# EasyEDA Pro project STM32F407ZG_Basics.epro, schematic Schematic1
Create Date: 2024-12-05; Page Name: P1; Project Name: STM32F407ZG_Basics; Schematic Name: Schematic1; Update Date: 2024-12-05; Company: 嘉立创EDA; Page Size: A4; Version: V1.0
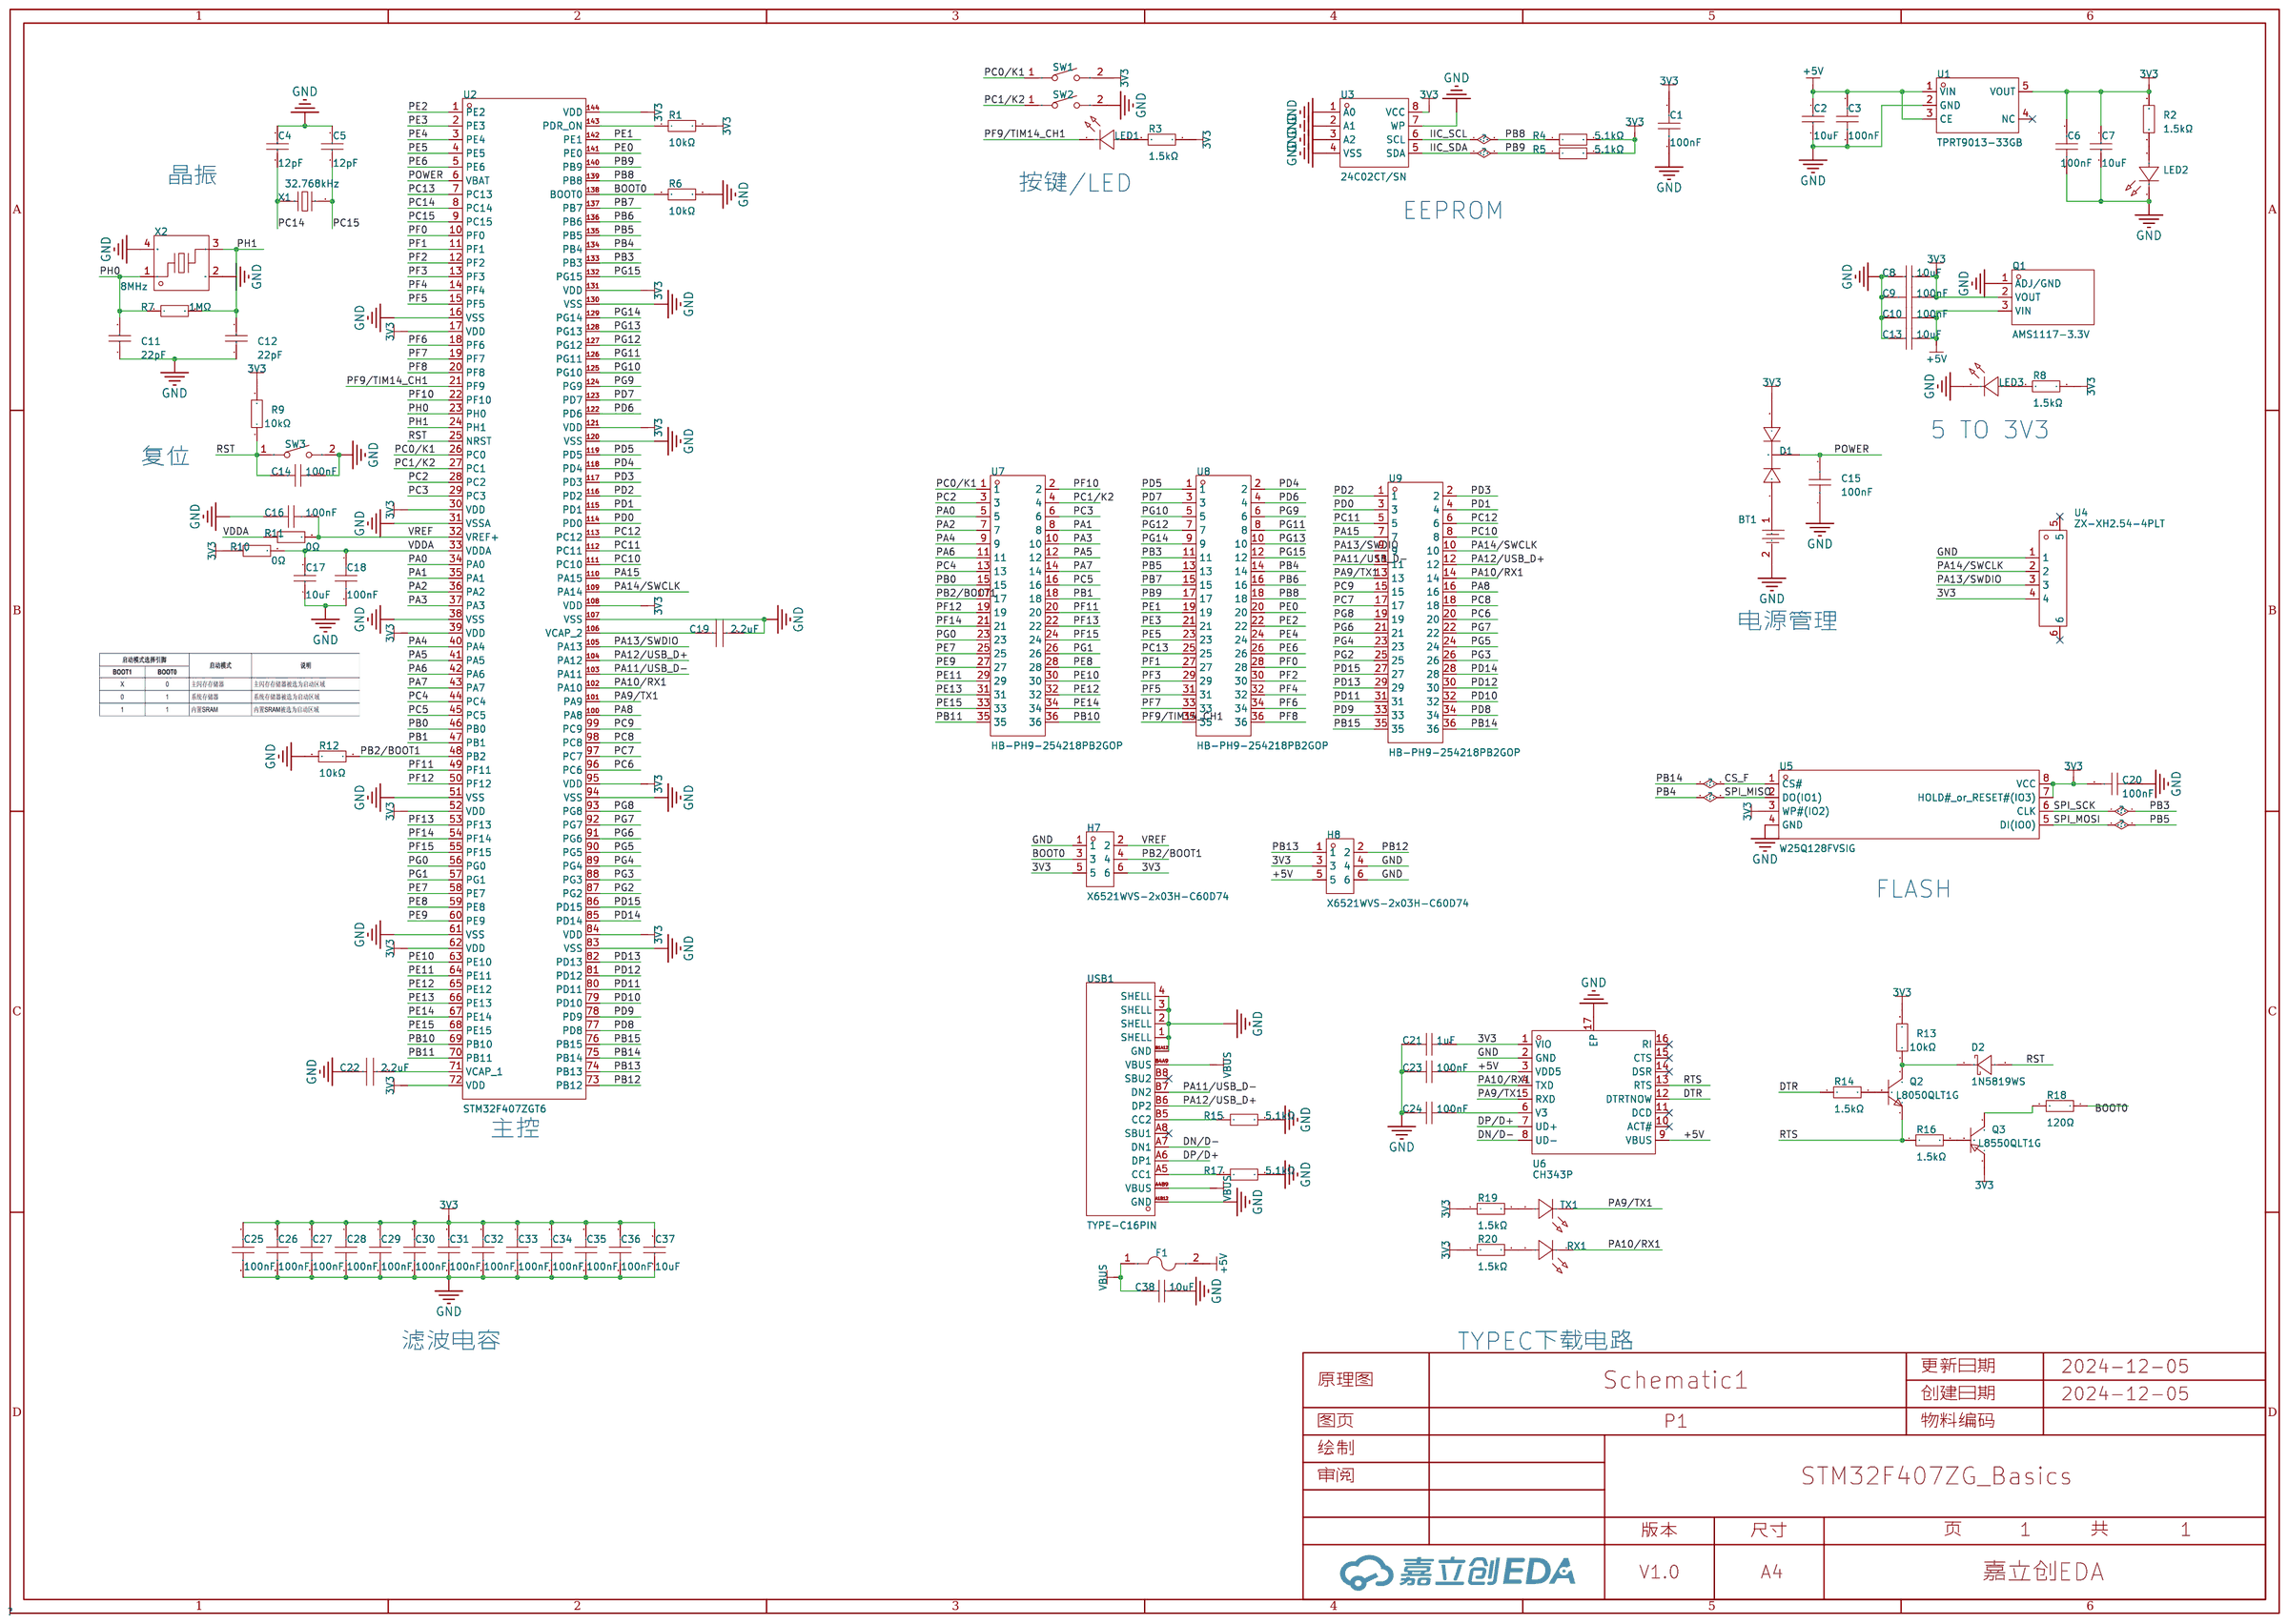
[diagram p0: schematic sheet]

## Parts
BT1  CR1220-2ZX  [BAT-SMD_CR1220-2ZX]
C1  100nF  [C0402]
C2  10uF  [C0402]
C3  100nF  [C0402]
C4  12pF  [C0402]
C5  12pF  [C0402]
C6  100nF  [C0402]
C7  10uF  [C0402]
C8  10uF  [C0402]
C9  100nF  [C0402]
C10  100nF  [C0402]
C11  22pF  [C0402]
C12  22pF  [C0402]
C13  10uF  [C0402]
C14  100nF  [C0402]
C15  100nF  [C0402]
C16  100nF  [C0402]
C17  10uF  [C0402]
C18  100nF  [C0402]
C19  2.2uF  [C0402]
C20  100nF  [C0402]
C21  1uF  [C0402]
C22  2.2uF  [C0402]
C23  100nF  [C0402]
C24  100nF  [C0402]
C25  100nF  [C0402]
C26  100nF  [C0402]
C27  100nF  [C0402]
C28  100nF  [C0402]
C29  100nF  [C0402]
C30  100nF  [C0402]
C31  100nF  [C0402]
C32  100nF  [C0402]
C33  100nF  [C0402]
C34  100nF  [C0402]
C35  100nF  [C0402]
C36  100nF  [C0402]
C37  10uF  [C0402]
C38  10uF  [C0402]
D1  SBAT54CLT1G  [SOT-23-3_L2.9-W1.6-P1.90-LS2.8-BR]
D2  1N5819WS  [SOD-323_L1.6-W1.3-LS2.6-RD-1]
F1  ASMD0805-075  [F0805]
H7  X6521WVS-2x03H-C60D74  [HDR-SMD_6P-P2.54-V-M-R2-C5-S7.4]
H8  X6521WVS-2x03H-C60D74  [HDR-SMD_6P-P2.54-V-M-R2-C5-S7.4]
LED1  XL-1608UGC-04  [LED0603-RD_GREEN]
LED2  XL-1608SURC-06  [LED0603-RD_RED]
LED3  XL-1608SURC-06  [LED0603-RD_RED]
Q1  AMS1117-3.3V  [SOT-89-3_L4.5-W2.5-P1.50-LS4.2-BR]
Q2  L8050QLT1G  [SOT-23-3_L2.9-W1.3-P1.90-LS2.4-BR]
Q3  L8550QLT1G  [SOT-23-3_L2.9-W1.6-P1.90-LS2.8-BR]
R1  10kΩ  [R0402]
R2  1.5kΩ  [R0402]
R3  1.5kΩ  [R0402]
R4  5.1kΩ  [R0402]
R5  5.1kΩ  [R0402]
R6  10kΩ  [R0402]
R7  1MΩ  [R0402]
R8  1.5kΩ  [R0402]
R9  10kΩ  [R0402]
R10  0Ω  [R0402]
R11  0Ω  [R0402]
R12  10kΩ  [R0402]
R13  10kΩ  [R0402]
R14  1.5kΩ  [R0402]
R15  5.1kΩ  [R0402]
R16  1.5kΩ  [R0402]
R17  5.1kΩ  [R0402]
R18  120Ω  [R0402]
R19  1.5kΩ  [R0402]
R20  1.5kΩ  [R0402]
RX1  XL-1608SURC-06  [LED0603-RD_RED]
SW1  TS-1088-AR02016  [SW-SMD_L3.9-W3.0-P4.45]
SW2  TS-1088-AR02016  [SW-SMD_L3.9-W3.0-P4.45]
SW3  TS-1088-AR02016  [SW-SMD_L3.9-W3.0-P4.45]
TX1  XL-1608SURC-06  [LED0603-RD_RED]
U1  TPRT9013-33GB  [SOT-23-5_L3.0-W1.7-P0.95-LS2.8-BL]
U2  STM32F407ZGT6  [LQFP-144_L20.0-W20.0-P0.50-LS22.0-BL]
U3  24C02CT/SN  [SOIC-8_L4.9-W3.9-P1.27-LS6.0-BL]
U4  ZX-XH2.54-4PLT  [CONN-SMD_4P-P2.54_C9900012758]
U5  W25Q128FVSIG  [SOIC-8_L5.3-W5.3-P1.27-LS8.0-BL]
U6  CH343P  [TQFN-16_L3.0-W3.0-P0.50-BL-EP1.7]
U7  HB-PH9-254218PB2GOP  [HDR-SMD_36P-P2.54-V-M-R2-C18-LS7.5]
U8  HB-PH9-254218PB2GOP  [HDR-SMD_36P-P2.54-V-M-R2-C18-LS7.5]
U9  HB-PH9-254218PB2GOP  [HDR-SMD_36P-P2.54-V-M-R2-C18-LS7.5]
USB1  TYPE-C16PIN  [USB-C-SMD_TYPE-C16PIN]
X1  32.768kHz  [OSC-SMD_L3.2-W1.5]
X2  8MHz  [OSC-SMD_4P-L3.2-W2.5-BL]

## Library data of the parts
BT1 = CR1220-2ZX: 连接器类型:电池底座;适用电池规格:CR1220;工作温度范围:-25℃~+85℃;; Supplier Part: C969906; Manufacturer: Q&J; Supplier Footprint: SMD; JLCPCB Part Class: 扩展库; Datasheet: https://atta.szlcsc.com/upload/public/pdf/source/20210107/C969906_C1D85B5C66CBBA4D1AEB8467FE1CEC7A.pdf; Supplier: LCSC; Connector Type: 电池底座; Battery Type: CR1220; Operating Temperature Range: -25℃~+85℃
C1 C3 C6 C9 C10 C14-C16 C18 C20 C23-C36 = CL05B104KB54PNC: 容值:100nF;精度:±10%;额定电压:50V;材质(温度系数):X7R;; LCSC Part Name: 100nF ±10% 50V; Supplier Part: C307331; Manufacturer: SAMSUNG(三星); Supplier Footprint: 0402; JLCPCB Part Class: 基础库; Datasheet: https://atta.szlcsc.com/upload/public/pdf/source/20160218/1457707763339.pdf; Supplier: LCSC; Tolerance: ±10%; Voltage Rated: 50V; Temperature Coefficient: X7R
C2 C7 C8 C13 C17 C37 C38 = CL05A106MQ5NUNC: 容值:10uF;精度:±20%;额定电压:6.3V;材质(温度系数):X5R;; LCSC Part Name: 10uF ±20% 6.3V; Supplier Part: C15525; Manufacturer: SAMSUNG(三星); Supplier Footprint: 0402; JLCPCB Part Class: 基础库; Datasheet: https://atta.szlcsc.com/upload/public/pdf/source/20220823/2B02EE04F8F211D38A52DCB16EB6BEBA.pdf; Supplier: LCSC; Tolerance: ±20%; Voltage Rated: 6.3V; Temperature Coefficient: X5R
C4 C5 = 0402CG120J500NT: 容值:12pF;精度:±5%;额定电压:50V;材质(温度系数):C0G;; LCSC Part Name: 12pF ±5% 50V; Supplier Part: C1547; Manufacturer: FH(风华); Supplier Footprint: 0402; JLCPCB Part Class: 基础库; Datasheet: https://atta.szlcsc.com/upload/public/pdf/source/20200305/C486355_26A10D38EF8C2A5C37091D0039909270.pdf; Supplier: LCSC; Tolerance: ±5%; Voltage Rated: 50V; Temperature Coefficient: C0G
C11 C12 = 0402CG220J500NT: 容值:22pF;精度:±5%;额定电压:50V;材质(温度系数):C0G;; LCSC Part Name: 22pF ±5% 50V; Supplier Part: C1555; Manufacturer: FH(风华); Supplier Footprint: 0402; JLCPCB Part Class: 基础库; Datasheet: https://atta.szlcsc.com/upload/public/pdf/source/20200305/C486355_26A10D38EF8C2A5C37091D0039909270.pdf; Supplier: LCSC; Tolerance: ±5%; Voltage Rated: 50V; Temperature Coefficient: C0G
C19 C22 = CL05A225MQ5NSNC: 容值:2.2uF;精度:±20%;额定电压:6.3V;材质(温度系数):X5R;; LCSC Part Name: 2.2uF ±20% 6.3V; Supplier Part: C12530; Manufacturer: SAMSUNG(三星); Supplier Footprint: 0402; JLCPCB Part Class: 基础库; Datasheet: https://atta.szlcsc.com/upload/public/pdf/source/20160218/1457707763339.pdf; Supplier: LCSC; Tolerance: ±20%; Voltage Rated: 6.3V; Temperature Coefficient: X5R
C21 = GRM155R61H105KE05D: 容值:1uF;精度:±10%;额定电压:50V;材质(温度系数):X5R;; LCSC Part Name: 1uF ±10% 50V; Supplier Part: C1518208; Manufacturer: muRata(村田); Supplier Footprint: 0402; JLCPCB Part Class: 扩展库; Datasheet: https://atta.szlcsc.com/upload/public/pdf/source/20210607/3F03D47137F6EC7729AB4067EB2A6EB3.pdf; Supplier: LCSC; Tolerance: ±10%; Voltage Rated: 50V; Temperature Coefficient: X5R
D1 = SBAT54CLT1G: 二极管配置:1对共阴极;正向压降(Vf):800mV@100mA;直流反向耐压(Vr):30V;平均整流电流(Io):200mA;; LCSC Part Name: 电压:30V 电流:200mA; Supplier Part: C124141; Manufacturer: onsemi(安森美); Supplier Footprint: SOT-23; JLCPCB Part Class: 扩展库; Datasheet: https://atta.szlcsc.com/upload/public/pdf/source/20180731/C232532_EC572B9E3069427E01FA5F4C989459D6.pdf; Supplier: LCSC; Diode Configuration: 1对共阴极; Forward Voltage (Vf@If): 800mV@100mA; Reverse Voltage (Vr): 30V; Average Rectified Current (Io): 200mA; Reverse Leakage Current (Ir): 2uA@25V
D2 = 1N5819WS: 正向压降(Vf):580mV@1A;直流反向耐压(Vr):40V;整流电流:1A;; LCSC Part Name: 电压:40V 电流:1A; Supplier Part: C2903903; Manufacturer: GOODWORK(固得沃克); Supplier Footprint: SOD-323; JLCPCB Part Class: 扩展库; Datasheet: https://atta.szlcsc.com/upload/public/pdf/source/20220114/BF6ECC8ED918A91A4FEA6F25B6F03A5F.pdf; Supplier: LCSC; Forward Voltage (Vf@If): 580mV@1A; Reverse Voltage (Vr): 40V; Rectified Current: 1A; Reverse Leakage Current (Ir): 50uA@40V
F1 = ASMD0805-075: 最大电压:6V;最大电流:40A;保持电流:750mA;跳闸电流:1.5A;; LCSC Part Name: 6V 750mA 0805自恢复; Supplier Part: C135330; Manufacturer: JDTfuse(集电通); Supplier Footprint: 0805; JLCPCB Part Class: 扩展库; Datasheet: https://atta.szlcsc.com/upload/public/pdf/source/20230515/CC6FBEFAAD08EE936C05ACEA13E8EAD9.pdf; Supplier: LCSC; Operating Voltage (Max): 6V; Current Rating (Max): 40A; Hold Current: 750mA; Trip Current: 1.5A; Power Dissipation: 600mW; Resistance - Initial (Ri) (Min): 90mΩ; Resistance - Post Trip (R1) (Max): 385mΩ; Maximum Time to Trip: 200ms; Operating Temperature: -40℃~+85℃
H7 H8 = X6521WVS-2x03H-C60D74: 插针结构:2x3P;间距:2.54mm;行距:2.54mm;圆针/方针:方针;安装类型:-;排数:双排;总PIN位数:6P;额定电流:3A;额定电压:250V;配合针长度:-;塑高:2.5mm;端接针长度:-;触头材质:黄铜;触头镀层:金;工作温度范围:-40℃~+105℃;焊接温度(最大值):260℃;颜色:黑色;; LCSC Part Name: 2x3P 间距:2.54mm 方针; Supplier Part: C780054; Manufacturer: XKB Connection(中国星坤); Supplier Footprint: SMD,P=2.54mm; JLCPCB Part Class: 扩展库; Datasheet: https://atta.szlcsc.com/upload/public/pdf/source/20211009/E3239EE5247E6BAFECB8B74A4FCF9AB8.pdf; Supplier: LCSC; Pin Structure: 2x3P; Pitch: 2.54mm; Row Spacing: 2.54mm; Circluar Pins/Square Pins: 方针; Number of Rows: 双排; Number of Pins: 6P; Current Rating (Max): 3A; Voltage Rating (Max): 250V; Insulation Height: 2.5mm; Contact Material: 黄铜; Contact Plating: 金; Operating Temperature Range: -40℃~+105℃; Soldering Temperature(Max): 260℃; Color: 黑色
LED1 = XL-1608UGC-04: 灯头类型:-;发光颜色:翠绿色;正向电压(VF):-;功率:80mW;正向电流:25mA;主波长:516nm~525nm;二极管配置:独立二极管;透镜颜色:无色透明透镜;色温:-;发光强度:-;发光角度:120°;载带方式:正贴;工作温度:-30℃~+85℃;; Supplier Part: C965804; Manufacturer: XINGLIGHT(成兴光); Supplier Footprint: 0603; JLCPCB Part Class: 扩展库; Datasheet: https://atta.szlcsc.com/upload/public/pdf/source/20221102/520D6E465E5CFD1609C8A4DBC80D4018.pdf; Supplier: LCSC; Emitted Color: 翠绿色; Power Dissipation: 80mW; Forward Current: 25mA; Dominant Wavelength: 516nm~525nm; Peak Wavelength: 534nm; Diode Configuration: 独立二极管; Lens Color: 无色透明透镜; Viewing Angle: 120°; Mounting Sytle: 正贴; Operating Temperature: -30℃~+85℃
LED2 LED3 RX1 TX1 = XL-1608SURC-06: 发光颜色:红色;功率:55mW;正向电流:25mA;主波长:617nm~621nm;透镜颜色:无色透明透镜;色温:-;发光角度:120°;载带方式:正贴;工作温度:-30℃~+85℃;; Supplier Part: C965799; Manufacturer: XINGLIGHT(成兴光); Supplier Footprint: 0603; JLCPCB Part Class: 扩展库; Datasheet: https://atta.szlcsc.com/upload/public/pdf/source/20221102/D860AFDD1CDB02C5A8064103A32707E2.pdf; Supplier: LCSC; Emitted Color: 红色; Power Dissipation: 55mW; Forward Current: 25mA; Dominant Wavelength: 617nm~621nm; Peak Wavelength: 623nm; Lens Color: 无色透明透镜; Viewing Angle: 120°; Mounting Sytle: 正贴; Operating Temperature: -30℃~+85℃
Q1 = AMS1117-3.3V_C5120796: 输出类型:固定;最大输入电压:18V;输出电压:3.3V;最大输出电流:1A;输出极性:正极;; LCSC Part Name: 输入18V 输出3.3V 1A; Supplier Part: C5120796; Manufacturer: MSKSEMI(美森科); Supplier Footprint: SOT-89; JLCPCB Part Class: 扩展库; Datasheet: https://atta.szlcsc.com/upload/public/pdf/source/20220727/5E62EAC46FFFF83337622C0FBE1B6BF8.pdf; Supplier: LCSC; Output Type: 固定; Maximum Input Voltage: 18V; Output Voltage: 3.3V; MAX Output Current: 1A; Dropout Voltage: 1.4V@(1A); standby current: 12mA; Operating Temperature: 0℃~+125℃; Output Polarity: 正极; Number of Outputs: 1
Q2 = L8050QLT1G: 晶体管类型:NPN;集电极电流(Ic):800mA;集射极击穿电压(Vceo):25V;功率(Pd):225mW;; LCSC Part Name: 耐压:25V 电流:800mA NPN; Supplier Part: C49581; Manufacturer: LRC(乐山无线电); Supplier Footprint: SOT-23; JLCPCB Part Class: 扩展库; Datasheet: https://atta.szlcsc.com/upload/public/pdf/source/20150518/1457707314424.pdf; Supplier: LCSC; Transistor Type: NPN; Collector Current (Ic): 800mA; Collector-Emitter Breakdown Voltage (Vceo): 25V; Power Dissipation (Pd): 225mW
Q3 = L8550QLT1G: 晶体管类型:PNP;集电极电流(Ic):800mA;集射极击穿电压(Vceo):25V;功率(Pd):225mW;; LCSC Part Name: 耐压:25V 电流:800mA PNP 150-300; Supplier Part: C127178; Manufacturer: LRC(乐山无线电); Supplier Footprint: SOT-23; JLCPCB Part Class: 扩展库; Datasheet: https://atta.szlcsc.com/upload/public/pdf/source/20171026/C127178_15089839291501058754.pdf; Supplier: LCSC; Transistor Type: PNP; Collector Current (Ic): 800mA; Collector-Emitter Breakdown Voltage (Vceo): 25V; Power Dissipation (Pd): 225mW; Collector Cut-Off Current (Icbo): 150nA; Collector-Emitter Saturation Voltage (VCE(sat)@Ic,Ib): 500mV@800mA,80mA; Operating Temperature: -55℃~+150℃@(Tj)
R1 R6 R9 R12 R13 = 0402WGF1002TCE: 电阻类型:厚膜电阻;阻值:10kΩ;精度:±1%;功率:62.5mW;最大工作电压:50V;温度系数:±100ppm/℃;; LCSC Part Name: 10kΩ ±1% 62.5mW 厚膜电阻; Supplier Part: C25744; Manufacturer: UNI-ROYAL(厚声); Supplier Footprint: 0402; JLCPCB Part Class: 基础库; Datasheet: https://atta.szlcsc.com/upload/public/pdf/source/20200306/C422600_1E6D84923E4A46A82E41ADD87F860B5C.pdf; Supplier: LCSC; Type: 厚膜电阻; Tolerance: ±1%; Power(Watts): 62.5mW; Overload Voltage (Max): 50V; Temperature Coefficient: ±100ppm/℃; Operating Temperature Range: -55℃~+155℃
R2 R3 R8 R14 R16 R19 R20 = RC0402FR-071K5L: 电阻类型:厚膜电阻;阻值:1.5kΩ;精度:±1%;功率:62.5mW;最大工作电压:50V;温度系数:±100ppm/℃;; LCSC Part Name: 厚膜电阻 1.5kΩ ±1% 62.5mW; Supplier Part: C114759; Manufacturer: YAGEO(国巨); Supplier Footprint: 0402; JLCPCB Part Class: 扩展库; Datasheet: https://atta.szlcsc.com/upload/public/pdf/source/20180821/C275644_0D56F95EFF785E7D9A1FEF436B37DA78.pdf; Supplier: LCSC; Type: 厚膜电阻; Tolerance: ±1%; Power(Watts): 62.5mW; Overload Voltage (Max): 50V; Temperature Coefficient: ±100ppm/℃; Operating Temperature Range: -55℃~+155℃
R4 R5 R15 R17 = RC0402FR-075K1L: 电阻类型:厚膜电阻;阻值:5.1kΩ;精度:±1%;功率:62.5mW;最大工作电压:50V;温度系数:±100ppm/℃;; LCSC Part Name: 厚膜电阻 5.1kΩ ±1% 62.5mW; Supplier Part: C105872; Manufacturer: YAGEO(国巨); Supplier Footprint: 0402; JLCPCB Part Class: 扩展库; Datasheet: https://atta.szlcsc.com/upload/public/pdf/source/20180821/C275644_0D56F95EFF785E7D9A1FEF436B37DA78.pdf; Supplier: LCSC; Type: 厚膜电阻; Tolerance: ±1%; Power(Watts): 62.5mW; Overload Voltage (Max): 50V; Temperature Coefficient: ±100ppm/℃; Operating Temperature Range: -55℃~+155℃
R7 = RC0402FR-071ML: 电阻类型:厚膜电阻;阻值:1MΩ;精度:±1%;功率:62.5mW;最大工作电压:50V;温度系数:±100ppm/℃;; LCSC Part Name: 厚膜电阻 1MΩ ±1% 62.5mW; Supplier Part: C138033; Manufacturer: YAGEO(国巨); Supplier Footprint: 0402; JLCPCB Part Class: 扩展库; Datasheet: https://atta.szlcsc.com/upload/public/pdf/source/20181009/C309620_DA5935B6E1D48212CB7A533FE518B3C2.pdf; Supplier: LCSC; Type: 厚膜电阻; Tolerance: ±1%; Power(Watts): 62.5mW; Overload Voltage (Max): 50V; Temperature Coefficient: ±100ppm/℃; Operating Temperature Range: -55℃~+155℃
R10 R11 = 0402WGF0000TCE: 电阻类型:厚膜电阻;阻值:0Ω;精度:±1%;功率:62.5mW;最大工作电压:50V;温度系数:±800ppm/℃;; LCSC Part Name: 0Ω ±1% 62.5mW 厚膜电阻; Supplier Part: C17168; Manufacturer: UNI-ROYAL(厚声); Supplier Footprint: 0402; JLCPCB Part Class: 基础库; Datasheet: https://atta.szlcsc.com/upload/public/pdf/source/20200306/C422600_1E6D84923E4A46A82E41ADD87F860B5C.pdf; Supplier: LCSC; Type: 厚膜电阻; Tolerance: ±1%; Power(Watts): 62.5mW; Overload Voltage (Max): 50V; Temperature Coefficient: ±800ppm/℃; Operating Temperature Range: -55℃~+155℃
R18 = RC0402FR-07120RL: 电阻类型:厚膜电阻;阻值:120Ω;精度:±1%;功率:62.5mW;最大工作电压:50V;温度系数:±100ppm/℃;; LCSC Part Name: 厚膜电阻 120Ω ±1% 62.5mW; Supplier Part: C114758; Manufacturer: YAGEO(国巨); Supplier Footprint: 0402; JLCPCB Part Class: 扩展库; Datasheet: https://atta.szlcsc.com/upload/public/pdf/source/20180821/C275644_0D56F95EFF785E7D9A1FEF436B37DA78.pdf; Supplier: LCSC; Type: 厚膜电阻; Tolerance: ±1%; Power(Watts): 62.5mW; Overload Voltage (Max): 50V; Temperature Coefficient: ±100ppm/℃; Operating Temperature Range: -55℃~+155℃
SW1-SW3 = TS-1088-AR02016: 电路结构:单刀单掷;按钮形状:圆形按钮;作用力:160gf;安装方式:立贴;开关长度:4mm;开关宽度:3mm;开关高度:2mm;带支架:不带;触点电流:50mA;额定电压(DC):12V;绝缘电阻:100MΩ;机械寿命:10万次;; LCSC Part Name: 4*3*2mm 立贴 轻触开关; Supplier Part: C720477; Manufacturer: XUNPU(讯普); Supplier Footprint: SMD; JLCPCB Part Class: 扩展库; Datasheet: https://atta.szlcsc.com/upload/public/pdf/source/20200810/C720475_60D09DD6C54279ADDB2DC25100F1CC11.pdf; Supplier: LCSC; Circuit: 单刀单掷; Actuator Style: 圆形按钮; Operating Force: 160gf; Mounting Style: 立贴; Switch Length: 4mm; Switch Width: 3mm; Switch Height: 2mm; Strike Gundam: 不带; Contact Current: 50mA; Voltage Rating (DC): 12V; Insulation Resistance: 100MΩ; Actuator/Cap Color: 黑色; Pin Style: SMD接片; Mechanical Life: 10万次; Operating Temperature: -30℃~+80℃
U1 = TPRT9013-33GB: 输出类型:-;; Supplier Part: C587158; Manufacturer: TECH PUBLIC(台舟); Supplier Footprint: SOT-23-5; JLCPCB Part Class: 扩展库; Datasheet: https://atta.szlcsc.com/upload/public/pdf/source/20210810/692D4D0C3CF190F9330EFD28C3E572CB.pdf; Supplier: LCSC
U2 = STM32F407ZGT6: CPU内核:ARM-M4;程序存储容量:1MB;RAM总容量:192KB;GPIO端口数量:114;工作电压范围:1.8V~3.6V;CPU最大主频:168MHz;程序存储器类型:FLASH;; LCSC Part Name: 带DSP和FPU的高性能基础系列ARM Cortex-M4 MCU，具有1 MB Flash、168 MHz CPU、ART加速器、以太网和FSMC; Supplier Part: C19156; Manufacturer: ST(意法半导体); Supplier Footprint: LQFP-144(20x20); JLCPCB Part Class: 扩展库; Datasheet: https://atta.szlcsc.com/upload/public/pdf/source/20140801/1457707197138.pdf; Supplier: LCSC; CPU Core: ARM-M4; Program Storage Size: 1MB; RAM Size: 192KB; GPIO Ports Number: 114; Operating Voltage Range: 1.8V~3.6V; CPU Maximum Speed: 168MHz; Program Memory Type: FLASH; Operating Temperature Range: -40℃~+85℃; ADC (Bit): 12bit; DAC (Bit): 12bit; Universal Serial Bus: 有; Peripheral/Function: DMA；LCD/LED驱动; Watchdog: 有; Infrared Data Association: 有; Low-Voltage Detect: 有; LCD Module: 有; Direct Memory Access: 有; Internal Oscillator: 有
U3 = 24C02CT/SN: 接口类型:I2C;存储容量:2Kbit;; Supplier Part: C2061394; Manufacturer: MICROCHIP(美国微芯); Supplier Footprint: SOIC-8; JLCPCB Part Class: 扩展库; Datasheet: https://atta.szlcsc.com/upload/public/pdf/source/20220111/F7F85E1FCBFD5D7B1B6878A28EC7AB57.pdf; Supplier: LCSC; Interface Type: I2C; Memory Size: 2Kbit; Supply Voltage: 4.5V~5.5V; Operating Temperature: 0℃~+70℃
U4 = ZX-XH2.54-4PLT: 插针结构:1x4P;间距:2.54mm;安装方式:立贴;参考系列:XH;总PIN数:4P;排数:1;每排PIN数:4;行距:-;额定电流:3A;触头材质:黄铜;触头镀层:锡;工作温度范围:-25℃~+85℃;; Supplier Part: C7429682; Manufacturer: Megastar(兆星); Supplier Footprint: SMD,P=2.54mm; JLCPCB Part Class: 扩展库; Datasheet: https://atta.szlcsc.com/upload/public/pdf/source/20230619/0839CF43A4681B40F50854985C226EB8.pdf; Supplier: LCSC; Pins Structure: 1x4P; Pitch: 2.54mm; Mounting Style: 立贴; Reference Series: XH; Number of Pins: 4P; Number of Rows: 1; Number of PINs Per Row: 4; Current Rating (Max): 3A; Contact Material: 黄铜; Contact Plating: 锡; Operating Temperature Range: -25℃~+85℃
U5 = W25Q128FVSIG: LCSC Part Name: W25Q128FVSIG 被合并商品; Supplier Part: C2974492; Supplier Footprint: SOIC-8-208mil; JLCPCB Part Class: 扩展库; Supplier: LCSC
U6 = CH343P: 应用功能:-;接口协议:-;; Supplier Part: C2846043; Manufacturer: WCH(南京沁恒); Supplier Footprint: TQFN-16-EP(3x3); JLCPCB Part Class: 扩展库; Datasheet: https://atta.szlcsc.com/upload/public/pdf/source/20211010/C2846043_7FA705E1F14A2906F6A2AFA45FA28209.pdf; Supplier: LCSC
U7-U9 = HB-PH9-254218PB2GOP: 插针结构:2x18P;间距:2.54mm;行距:2.54mm;圆针/方针:方针;排数:双排;总PIN位数:16P;额定电流:3A;额定电压:250V;配合针长度:6mm;塑高:2.54mm;触头材质:黄铜;触头镀层:金;工作温度范围:-40℃~+105℃;焊接温度(最大值):260℃;颜色:黑色;; LCSC Part Name: 间距:2.54mm 2x18P 方针; Supplier Part: C6332243; Manufacturer: HANBO(汉博); Supplier Footprint: SMD,P=2.54mm; JLCPCB Part Class: 扩展库; Datasheet: https://atta.szlcsc.com/upload/public/pdf/source/20230512/F975354EBE427BE6E34FADDF7D38A98F.pdf; Supplier: LCSC; Pin Structure: 2x18P; Pitch: 2.54mm; Row Spacing: 2.54mm; Circluar Pins/Square Pins: 方针; Number of Rows: 双排; Number of Pins: 16P; Current Rating (Max): 3A; Voltage Rating (Max): 250V; Length of Mating Pin: 6mm; Insulation Height: 2.54mm; Contact Material: 黄铜; Contact Plating: 金; Operating Temperature Range: -40℃~+105℃; Soldering Temperature(Max): 260℃; Color: 黑色
USB1 = TYPE-C16PIN: 连接器类型:Type-C;标准:USB 3.1;公母:母;安装方式:卧贴;触点数量:16P;端口数量:1;额定电流 - 电源:3A;工作温度范围:-40℃~+85℃;; LCSC Part Name: Type-C 母 卧贴; Supplier Part: C393939; Manufacturer: SHOU HAN(首韩); Supplier Footprint: SMD; JLCPCB Part Class: 扩展库; Datasheet: https://atta.szlcsc.com/upload/public/pdf/source/20190521/C393939_7B9043D4CF1026AF443AB60D91FBCD5C.pdf; Supplier: LCSC; Connector Type: Type-C; Standard: USB 3.1; Gender: 母; Mounting Style: 卧贴; Number of Contacts: 16P; Number of Ports: 1; Current Rating - Power (Max): 3A; Operating Temperature Range: -40℃~+85℃; Rated Voltage (Max): 30V; Connect-Disconnect Life: 1万次; Core Colour: 黑色
X1 = X321532768KGD2SI: 晶振类型:贴片晶振;频率:32.768kHz;常温频差:±20ppm;外接负载电容:12.5pF;频率稳定度(全温):-;; LCSC Part Name: 32.768kHz ±20ppm 12.5pF; Supplier Part: C620155; Manufacturer: YXC(扬兴晶振); Supplier Footprint: SMD3215-2P; JLCPCB Part Class: 扩展库; Datasheet: https://atta.szlcsc.com/upload/public/pdf/source/20240329/3A7650FD985DD0DE85694D3785AB4916.pdf; Supplier: LCSC; Crystal Type: 贴片晶振; Normal temperature Frequency Tolerance: ±20ppm; External load capacitor: 12.5pF; Operating Temperature: -40℃~+85℃
X2 = X32258MOB4SI: 晶振类型:贴片晶振;频率:8MHz;常温频差:±10ppm;外接负载电容:12pF;频率稳定度(全温):±20ppm;; LCSC Part Name: 8MHz ±10ppm 12pF; Supplier Part: C2682775; Manufacturer: YXC(扬兴晶振); Supplier Footprint: SMD3225-4P; JLCPCB Part Class: 扩展库; Datasheet: https://atta.szlcsc.com/upload/public/pdf/source/20240329/19D5F850207469550BEB00D7DFEDBC7A.pdf; Supplier: LCSC; Crystal Type: 贴片晶振; Normal temperature Frequency Tolerance: ±10ppm; External load capacitor: 12pF; Frequency Stability(Full temperature range): ±20ppm; Equivalent Series Resistance (ESR): 150Ω; Operating Temperature: -40℃~+85℃

## Nets
3V3: C1.2 C6.2 C7.1 C8.1 C9.2 C20.2 C21.2 C25.1 C26.1 C27.1 C28.1 C29.1 C30.1 C31.1 C32.1 C33.1 C34.1 C35.1 C36.1 C37.2 D1.2(A) H7.5 H7.6 H8.3 Q1.2(VOUT) Q3.2(E) R1.2 R2.2 R3.1 R4.2 R5.2 R8.1 R9.2 R10.1 R13.2 R19.1 R20.1 SW1.2 U1.5(VOUT) U2.17(VDD) U2.30(VDD) U2.39(VDD) U2.52(VDD) U2.62(VDD) U2.72(VDD) U2.84(VDD) U2.95(VDD) U2.108(VDD) U2.121(VDD) U2.131(VDD) U2.144(VDD) U3.8(VCC) U4.4 U5.3(WP#(IO2)) U5.7(HOLD# or RESET#(IO3)) U5.8(VCC) U6.1(VIO)
+5V: C2.1 C3.2 C10.2 C13.1 C23.2 F1.2 H8.5 Q1.3(VIN) U1.1(VIN) U1.3(CE) U6.3(VDD5) U6.9(VBUS)
GND: BT1.2 C1.1 C2.2 C3.1 C4.1 C5.1 C6.1 C7.2 C8.2 C9.1 C10.1 C11.1 C12.1 C13.2 C14.2 C15.1 C16.1 C17.1 C18.2 C19.2 C20.1 C21.1 C22.1 C23.1 C24.1 C25.2 C26.2 C27.2 C28.2 C29.2 C30.2 C31.2 C32.2 C33.2 C34.2 C35.2 C36.2 C37.1 C38.2 H7.1 H8.4 H8.6 LED2.1(K) LED3.1(K) Q1.1(ADJ/GND) R6.2 R12.1 R15.2 R17.2 SW2.2 SW3.2 U1.2(GND) U2.16(VSS) U2.31(VSSA) U2.38(VSS) U2.51(VSS) U2.61(VSS) U2.83(VSS) U2.94(VSS) U2.107(VSS) U2.120(VSS) U2.130(VSS) U3.1(A0) U3.2(A1) U3.3(A2) U3.4(VSS) U3.7(WP) U4.1 U5.4(GND) U6.2(GND) U6.17(EP) USB1.1(SHELL) USB1.2(SHELL) USB1.3(SHELL) USB1.4(SHELL) USB1.A1B12(GND) USB1.B1A12(GND) X2.2(GND) X2.4(GND)
VBUS: C38.1 F1.1 USB1.A4B9(VBUS) USB1.B4A9(VBUS)
VDDA: C17.2 C18.1 R10.2 R11.1 U2.33(VDDA)
BOOT0: H7.3 R6.1 R18.1 U2.138(BOOT0)
CS_F: U2.75(PB14) U5.1(CS#) U9.36
DN/D-: U6.8(UD-) USB1.A7(DN1)
DP/D+: U6.7(UD+) USB1.A6(DP1)
DTR: R14.1 U6.12(DTRTNOW)
IIC_SCL: R4.1 U2.139(PB8) U3.6(SCL) U8.18
IIC_SDA: R5.1 U2.140(PB9) U3.5(SDA) U8.17
PA0: U2.34(PA0) U7.5
PA1: U2.35(PA1) U7.8
PA2: U2.36(PA2) U7.7
PA3: U2.37(PA3) U7.10
PA4: U2.40(PA4) U7.9
PA5: U2.41(PA5) U7.12
PA6: U2.42(PA6) U7.11
PA7: U2.43(PA7) U7.14
PA8: U2.100(PA8) U9.16
PA9/TX1: TX1.1(K) U2.101(PA9) U6.5(RXD) U9.13
PA10/RX1: RX1.1(K) U2.102(PA10) U6.4(TXD) U9.14
PA11/USB_D-: U2.103(PA11) U9.11 USB1.B7(DN2)
PA12/USB_D+: U2.104(PA12) U9.12 USB1.B6(DP2)
PA13/SWDIO: U2.105(PA13) U4.3 U9.9
PA14/SWCLK: U2.109(PA14) U4.2 U9.10
PA15: U2.110(PA15) U9.7
PB0: U2.46(PB0) U7.15
PB1: U2.47(PB1) U7.18
PB2/BOOT1: H7.4 R12.2 U2.48(PB2) U7.17
PB3: U2.133(PB3) U5.6(CLK) U8.11
PB4: U2.134(PB4) U5.2(DO(IO1)) U8.14
PB5: U2.135(PB5) U5.5(DI(IO0)) U8.13
PB6: U2.136(PB6) U8.16
PB7: U2.137(PB7) U8.15
PB10: U2.69(PB10) U7.36
PB11: U2.70(PB11) U7.35
PB12: H8.2 U2.73(PB12)
PB13: H8.1 U2.74(PB13)
PB15: U2.76(PB15) U9.35
PC0/K1: SW1.1 U2.26(PC0) U7.1
PC1/K2: SW2.1 U2.27(PC1) U7.4
PC2: U2.28(PC2) U7.3
PC3: U2.29(PC3) U7.6
PC4: U2.44(PC4) U7.13
PC5: U2.45(PC5) U7.16
PC6: U2.96(PC6) U9.20
PC7: U2.97(PC7) U9.17
PC8: U2.98(PC8) U9.18
PC9: U2.99(PC9) U9.15
PC10: U2.111(PC10) U9.8
PC11: U2.112(PC11) U9.5
PC12: U2.113(PC12) U9.6
PC13: U2.7(PC13) U8.25
PC14: C4.2 U2.8(PC14) X1.1
PC15: C5.2 U2.9(PC15) X1.2
PD0: U2.114(PD0) U9.3
PD1: U2.115(PD1) U9.4
PD2: U2.116(PD2) U9.1
PD3: U2.117(PD3) U9.2
PD4: U2.118(PD4) U8.2
PD5: U2.119(PD5) U8.1
PD6: U2.122(PD6) U8.4
PD7: U2.123(PD7) U8.3
PD8: U2.77(PD8) U9.34
PD9: U2.78(PD9) U9.33
PD10: U2.79(PD10) U9.32
PD11: U2.80(PD11) U9.31
PD12: U2.81(PD12) U9.30
PD13: U2.82(PD13) U9.29
PD14: U2.85(PD14) U9.28
PD15: U2.86(PD15) U9.27
PE0: U2.141(PE0) U8.20
PE1: U2.142(PE1) U8.19
PE2: U2.1(PE2) U8.22
PE3: U2.2(PE3) U8.21
PE4: U2.3(PE4) U8.24
PE5: U2.4(PE5) U8.23
PE6: U2.5(PE6) U8.26
PE7: U2.58(PE7) U7.25
PE8: U2.59(PE8) U7.28
PE9: U2.60(PE9) U7.27
PE10: U2.63(PE10) U7.30
PE11: U2.64(PE11) U7.29
PE12: U2.65(PE12) U7.32
PE13: U2.66(PE13) U7.31
PE14: U2.67(PE14) U7.34
PE15: U2.68(PE15) U7.33
PF0: U2.10(PF0) U8.28
PF1: U2.11(PF1) U8.27
PF2: U2.12(PF2) U8.30
PF3: U2.13(PF3) U8.29
PF4: U2.14(PF4) U8.32
PF5: U2.15(PF5) U8.31
PF6: U2.18(PF6) U8.34
PF7: U2.19(PF7) U8.33
PF8: U2.20(PF8) U8.36
PF9/TIM14_CH1: LED1.1(K) U2.21(PF9) U8.35
PF10: U2.22(PF10) U7.2
PF11: U2.49(PF11) U7.20
PF12: U2.50(PF12) U7.19
PF13: U2.53(PF13) U7.22
PF14: U2.54(PF14) U7.21
PF15: U2.55(PF15) U7.24
PG0: U2.56(PG0) U7.23
PG1: U2.57(PG1) U7.26
PG2: U2.87(PG2) U9.25
PG3: U2.88(PG3) U9.26
PG4: U2.89(PG4) U9.23
PG5: U2.90(PG5) U9.24
PG6: U2.91(PG6) U9.21
PG7: U2.92(PG7) U9.22
PG8: U2.93(PG8) U9.19
PG9: U2.124(PG9) U8.6
PG10: U2.125(PG10) U8.5
PG11: U2.126(PG11) U8.8
PG12: U2.127(PG12) U8.7
PG13: U2.128(PG13) U8.10
PG14: U2.129(PG14) U8.9
PG15: U2.132(PG15) U8.12
PH0: C11.2 R7.1 U2.23(PH0) X2.1
PH1: C12.2 R7.2 U2.24(PH1) X2.3
POWER: C15.2 D1.3(C) U2.6(VBAT)
RST: C14.1 D2.2(A) R9.1 SW3.1 U2.25(NRST)
RTS: Q2.2(E) R16.1 U6.13(RTS)
VREF: C16.2 H7.2 R11.2 U2.32(VREF+)
$1N3432: R1.1 U2.143(PDR_ON)
$1N3503: C19.1 U2.106(VCAP_2)
$1N3607: C22.2 U2.71(VCAP_1)
$1N5532: BT1.1 D1.1(A)
$1N6115: LED2.2(A) R2.1
$1N7262: R15.1 USB1.B5(CC2)
$1N7303: R17.1 USB1.A5(CC1)
$1N7864: C24.2 U6.6(V3)
$1N8061: R19.2 TX1.2(A)
$1N8103: R20.2 RX1.2(A)
$1N8304: Q2.1(B) R14.2
$1N8343: D2.1(K) Q2.3(C) R13.1
$1N8469: Q3.1(B) R16.2
$1N18412: LED1.2(A) R3.2
$1N26831: Q3.3(C) R18.2
Net-(LED3-2): LED3.2(A) R8.2

Not connected (* = marked no-connect by the designer): U1 4(NC)*; U4 5* 6*; U6 10(ACT#)* 11(DCD)* 14(DSR)* 15(CTS)* 16(RI)*; USB1 A8(SBU1)* B8(SBU2)*

## Notes on the sheet
- 晶振
- 按键/LED
- EEPROM
- 5 TO 3V3
- 复位
- 电源管理
- FLASH
- 主控
- 滤波电容
- TYPEC下载电路
